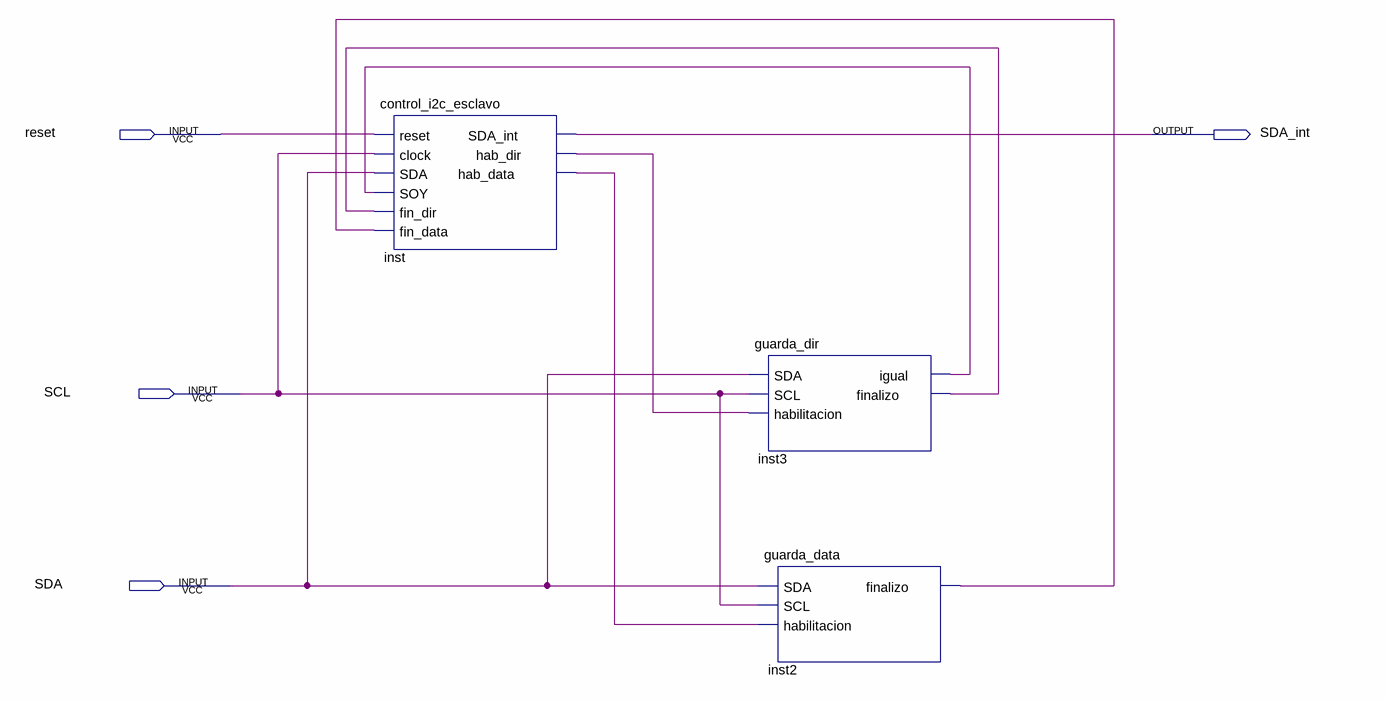
[diagram p0: schematic sheet]
// Quartus schematic i2c_esclavo_completo.bdf as structural Verilog: 3 symbols, 4 pins
module i2c_esclavo_completo (
  input  reset,
  input  SCL,
  input  SDA,
  output SDA_int
);

  wire inst2_finalizo, inst3_finalizo, inst3_igual, inst_hab_data, inst_hab_dir;

  control_i2c_esclavo inst (
    .reset(reset), .clock(SCL), .SDA(SDA), .SOY(inst3_igual), .fin_dir(inst3_finalizo),
    .fin_data(inst2_finalizo), .SDA_int(SDA_int), .hab_dir(inst_hab_dir), .hab_data(inst_hab_data));
  guarda_dir inst3 (.SDA(SDA), .SCL(SCL), .habilitacion(inst_hab_dir), .igual(inst3_igual), .finalizo(inst3_finalizo));
  guarda_data inst2 (.SDA(SDA), .SCL(SCL), .habilitacion(inst_hab_data), .finalizo(inst2_finalizo));
endmodule
